# Altium schematic sheet Peripheral Device.SchDoc: Peripheral Device
size A3; DrawnBy: P.Z.P; Revision: 0.0.1; SheetNumber: 3; SheetTotal: 3
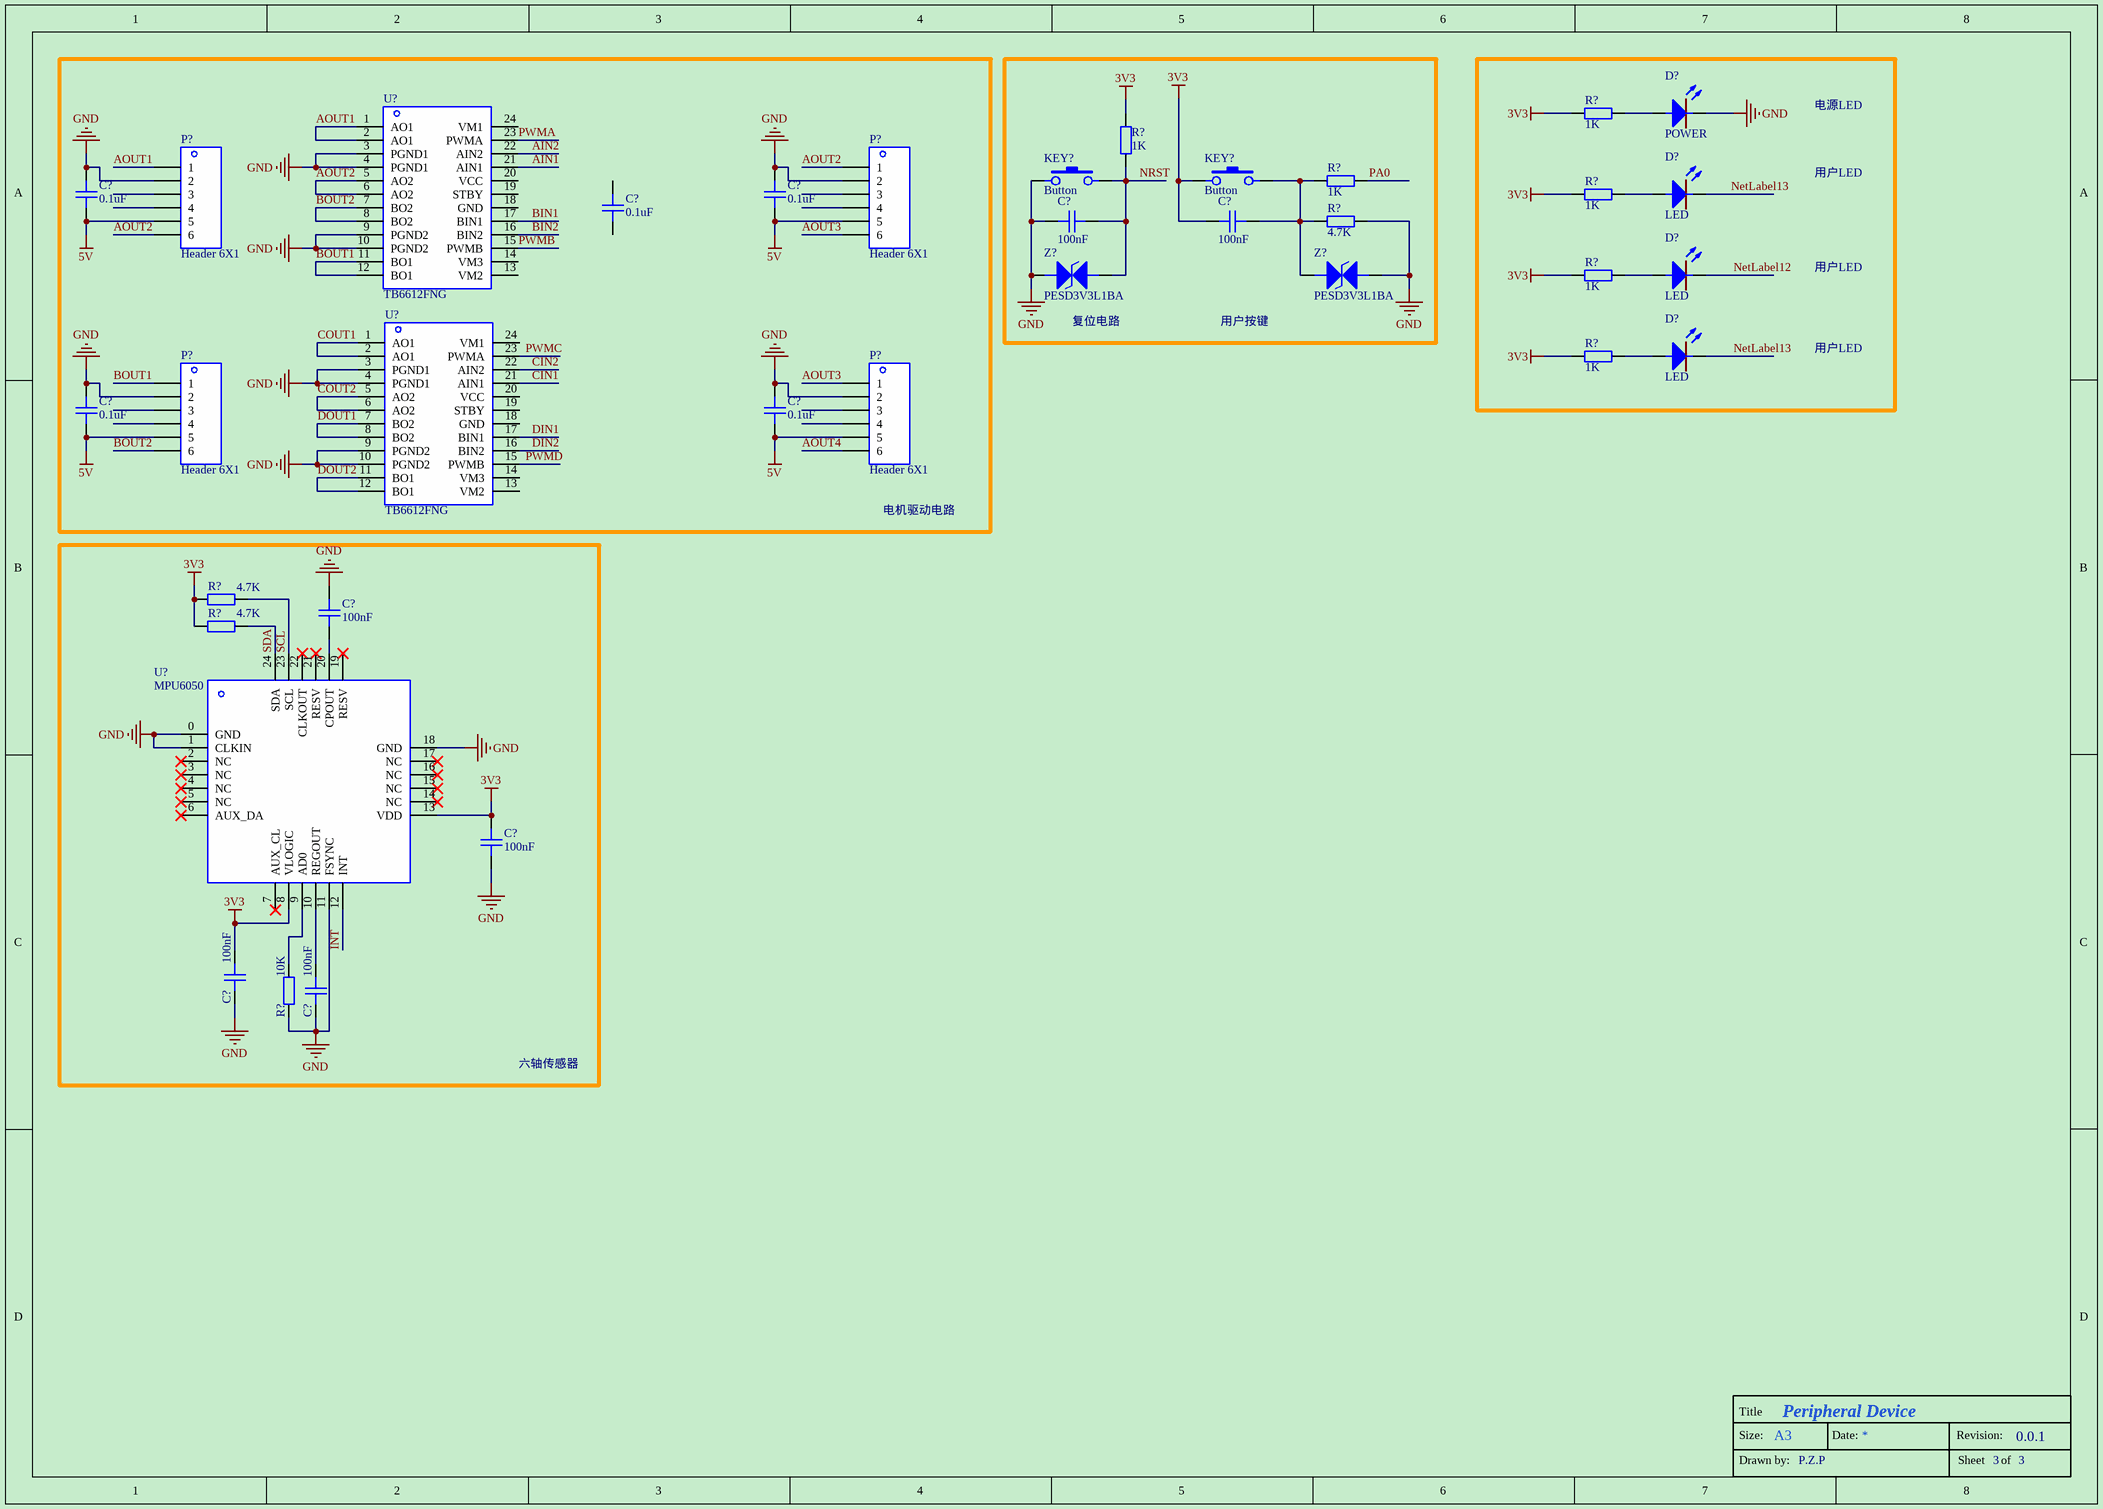
[diagram p0: Peripheral Device.SchDoc]

## Parts
(Parts that share a designator on the sheet are numbered #1, #2 ... from top to bottom, then left to right.)
C?#1  0.1uF  [0603L]
C?#2  0.1uF  [0603L]
C?#3  0.1uF  [0603L]
C?#4  100nF  [0603L]
C?#5  100nF  [0603L]
C?#6  0.1uF  [0603L]
C?#7  0.1uF  [0603L]
C?#8  100nF  [0603L]
C?#9  100nF  [0603L]
C?#10  100nF  [0603L]
C?#11  100nF  [0603L]
D?#1  POWER  [0603L]
D?#2  LED  [0603L]
D?#3  LED  [0603L]
D?#4  LED  [0603L]
KEY?#1  Button  [SWT3*4]
KEY?#2  Button  [SWT3*4]
P?#1  Header 6X1  [HDR6X1]
P?#2  Header 6X1  [HDR6X1]
P?#3  Header 6X1  [HDR6X1]
P?#4  Header 6X1  [HDR6X1]
R?#1  1K  [0603L]
R?#2  1K  [0603L]
R?#3  1K  [0603L]
R?#4  1K  [0603L]
R?#5  4.7K  [0603L]
R?#6  1K  [0603L]
R?#7  1K  [0603L]
R?#8  4.7K  [0603L]
R?#9  4.7K  [0603L]
R?#10  10K  [0603L]
U?#1  TB6612FNG
U?#2  TB6612FNG
U?#3  MPU6050
Z?#1  PESD3V3L1BA  [SOD-323]
Z?#2  PESD3V3L1BA  [SOD-323]

## Blocks framed on the sheet
电机驱动电路: C?#1-C?#3 C?#6 C?#7 P?#1-P?#4 U?#1 U?#2
六轴传感器: C?#8-C?#11 R?#8-R?#10 U?#3

## Nets
3V3: C?#5.1 C?#9.2 C?#10.1 KEY?#2.2 R?#1.1 R?#2.2 R?#4.1 R?#6.1 R?#7.1 R?#8.1 R?#9.1 U?#3.8(VLOGIC) U?#3.13(VDD)
5V: C?#1.1 C?#2.1 C?#6.1 C?#7.1 P?#1.5 P?#2.5 P?#3.5 P?#4.5
GND: C?#1.2 C?#2.2 C?#4.1 C?#6.2 C?#7.2 C?#8.1 C?#9.1 C?#10.2 C?#11.2 D?#1.2(K) KEY?#1.2 P?#1.2 P?#2.2 P?#3.2 P?#4.2 R?#5.2 R?#10.1 U?#1.3(PGND1) U?#1.4(PGND1) U?#1.9(PGND2) U?#1.10(PGND2) U?#2.3(PGND1) U?#2.4(PGND1) U?#2.9(PGND2) U?#2.10(PGND2) U?#3.0(GND) U?#3.1(CLKIN) U?#3.11(FSYNC) U?#3.18(GND) Z?#1.2 Z?#2.1
AIN1: U?#1.21(AIN1)
AIN2: U?#1.22(AIN2)
AOUT1: P?#1.1 U?#1.1(AO1) U?#1.2(AO1)
AOUT2: P?#1.6 P?#2.1 U?#1.5(AO2) U?#1.6(AO2)
AOUT3: P?#2.6 P?#4.1
AOUT4: P?#4.6
BIN1: U?#1.17(BIN1)
BIN2: U?#1.16(BIN2)
BOUT1: P?#3.1 U?#1.11(BO1) U?#1.12(BO1)
BOUT2: P?#3.6 U?#1.7(BO2) U?#1.8(BO2)
CIN1: U?#2.21(AIN1)
CIN2: U?#2.22(AIN2)
COUT1: U?#2.1(AO1) U?#2.2(AO1)
COUT2: U?#2.5(AO2) U?#2.6(AO2)
DIN1: U?#2.17(BIN1)
DIN2: U?#2.16(BIN2)
DOUT1: U?#2.7(BO2) U?#2.8(BO2)
DOUT2: U?#2.11(BO1) U?#2.12(BO1)
INT: U?#3.12(INT)
NetLabel12: D?#3.2(K)
NetLabel13: D?#2.2(K) D?#4.2(K)
NRST: C?#4.2 KEY?#1.1 R?#2.1 Z?#1.1
PA0: R?#3.2
PWMA: U?#1.23(PWMA)
PWMB: U?#1.15(PWMB)
PWMC: U?#2.23(PWMA)
PWMD: U?#2.15(PWMB)
SCL: R?#8.2 U?#3.23(SCL)
SDA: R?#9.2 U?#3.24(SDA)
NetC?#5_2: C?#5.2 KEY?#2.1 R?#3.1 R?#5.1 Z?#2.2
NetC?#8_2: C?#8.2 U?#3.20(CPOUT)
NetC?#11_1: C?#11.1 U?#3.10(REGOUT)
NetD?#1_1: D?#1.1(A) R?#1.2
NetD?#2_1: D?#2.1(A) R?#4.2
NetD?#3_1: D?#3.1(A) R?#6.2
NetD?#4_1: D?#4.1(A) R?#7.2
NetR?#10_2: R?#10.2 U?#3.9(AD0)

Not connected (* = marked no-connect by the designer): C?#3 1 2; P?#1 3 4; P?#2 3 4; P?#3 3 4; P?#4 3 4; U?#1 13(VM2) 14(VM3) 18(GND) 19(STBY) 20(VCC) 24(VM1); U?#2 13(VM2) 14(VM3) 18(GND) 19(STBY) 20(VCC) 24(VM1); U?#3 2(NC)* 3(NC)* 4(NC)* 5(NC)* 6(AUX_DA)* 7(AUX_CL)* 14(NC)* 15(NC)* 16(NC)* 17(NC)* 19(RESV)* 21(RESV)* 22(CLKOUT)*

## Notes on the sheet
- 电源LED
- 用户LED
- (near Z?#1) 复位电路
- 用户按键
- Title
- Size:
- Drawn by:
- A3
- Date:
- Revision:
- Sheet
- of

## Library data of the parts
C?#1-C?#11 = Cap1: 无级电容
  C?#1-C?#3 C?#6 C?#7: value: 0.1uF
  C?#4 C?#5 C?#8-C?#11: value: 100nF
D?#1 = LED2: 电源指示灯
D?#2-D?#4 = LED1: 灯
KEY?#1 KEY?#2 = KEY1: 非自锁按键
P?#1-P?#4 = Header 6X1: Header, 6-Pin
R?#1-R?#10 = Res: 电阻
  R?#1-R?#4 R?#6 R?#7: value: 1K
  R?#5 R?#8 R?#9: value: 4.7K
  R?#10: value: 10K
Z?#1 Z?#2 = ESD: 静电阻抗器